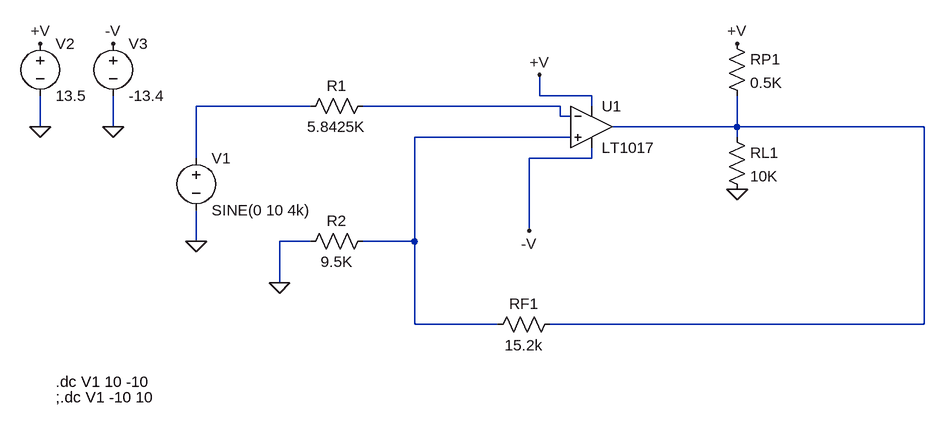
[diagram p0: schematic EJERCICO1c-5.asc]
EJERCICO1c-5.asc, the LTspice schematic file:
Version 4
SHEET 1 1028 680
WIRE 432 144 432 112
WIRE 512 144 432 144
WIRE 80 160 -96 160
WIRE 464 160 160 160
WIRE 512 160 512 144
WIRE 464 176 464 160
WIRE 480 176 464 176
WIRE -336 192 -336 144
WIRE -224 192 -224 144
WIRE 736 192 736 144
WIRE 736 192 544 192
WIRE 1024 192 736 192
WIRE 480 208 240 208
WIRE 736 208 736 192
WIRE -96 240 -96 160
WIRE 512 240 512 224
WIRE 512 240 416 240
WIRE 416 352 416 240
WIRE -96 368 -96 320
WIRE 80 368 32 368
WIRE 240 368 240 208
WIRE 240 368 160 368
WIRE 32 432 32 368
WIRE 240 496 240 368
WIRE 368 496 240 496
WIRE 1024 496 1024 192
WIRE 1024 496 448 496
FLAG -96 368 0
FLAG 32 432 0
FLAG 432 112 +V
FLAG 416 352 -V
FLAG 736 288 0
FLAG 736 64 +V
FLAG -336 192 0
FLAG -224 192 0
FLAG -336 64 +V
FLAG -224 64 -V
SYMBOL res 176 144 R90
WINDOW 0 0 56 VBottom 2
WINDOW 3 32 56 VTop 2
SYMATTR InstName R1
SYMATTR Value 5.8425K
SYMBOL res 176 352 R90
WINDOW 0 0 56 VBottom 2
WINDOW 3 32 56 VTop 2
SYMATTR InstName R2
SYMATTR Value 9.5K
SYMBOL res 464 480 R90
WINDOW 0 0 56 VBottom 2
WINDOW 3 32 56 VTop 2
SYMATTR InstName RF1
SYMATTR Value 15.2k
SYMBOL res 720 192 R0
SYMATTR InstName RL1
SYMATTR Value 10K
SYMBOL res 720 48 R0
SYMATTR InstName RP1
SYMATTR Value 0.5K
SYMBOL LT1017 512 192 R0
SYMATTR InstName U1
SYMBOL voltage -96 224 R0
WINDOW 123 0 0 Left 2
WINDOW 39 0 0 Left 2
SYMATTR InstName V1
SYMATTR Value SINE(0 10 4k)
SYMBOL voltage -336 48 R0
WINDOW 123 0 0 Left 2
WINDOW 39 0 0 Left 2
SYMATTR InstName V2
SYMATTR Value 13.5
SYMBOL voltage -224 48 R0
WINDOW 123 0 0 Left 2
WINDOW 39 0 0 Left 2
SYMATTR InstName V3
SYMATTR Value -13.4
TEXT -312 584 Left 2 !.dc V1 10 -10
TEXT -312 608 Left 2 !;.dc V1 -10 10

The netlist it stands for:
* EJERCICO1c-5.asc
R1 N002 N001 5.8425K
R2 N004 0 9.5K
RF1 N003 N004 15.2k
RL1 N003 0 10K
RP1 +V N003 0.5K
XU1 N004 N002 +V -V N003 LT1017  ; pins In+ In- V+ V- OUT
V1 N001 0 SINE(0 10 4k)
V2 +V 0 13.5
V3 -V 0 -13.4
.dc V1 10 -10
;.dc V1 -10 10
.backanno
.end